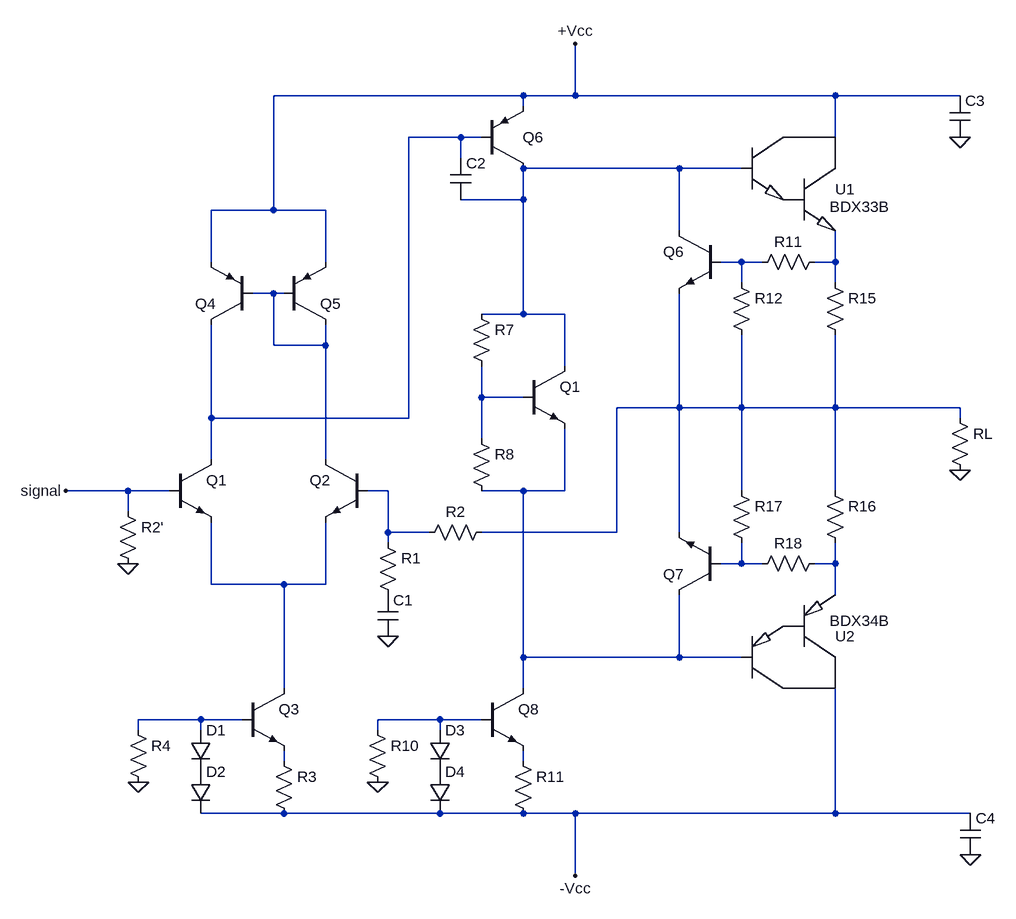
[diagram p0: schematic effektforstaerkerclean.asc]
effektforstaerkerclean.asc, the LTspice schematic file:
Version 4
SHEET 1 952 996
WIRE -16 -304 -400 -304
WIRE 64 -304 64 -384
WIRE 64 -304 -16 -304
WIRE 464 -304 64 -304
WIRE 656 -304 464 -304
WIRE -16 -288 -16 -304
WIRE -112 -240 -192 -240
WIRE -80 -240 -112 -240
WIRE 464 -240 464 -304
WIRE -112 -208 -112 -240
WIRE 224 -192 -16 -192
WIRE 320 -192 224 -192
WIRE -16 -144 -16 -192
WIRE -16 -144 -112 -144
WIRE -400 -128 -400 -304
WIRE -400 -128 -496 -128
WIRE -320 -128 -400 -128
WIRE 224 -96 224 -192
WIRE -496 -48 -496 -128
WIRE -320 -48 -320 -128
WIRE 320 -48 288 -48
WIRE 352 -48 320 -48
WIRE 464 -48 464 -96
WIRE 464 -48 432 -48
WIRE 320 -16 320 -48
WIRE 464 -16 464 -48
WIRE -400 0 -432 0
WIRE -384 0 -400 0
WIRE -16 32 -16 -144
WIRE -16 32 -80 32
WIRE 48 32 -16 32
WIRE -400 80 -400 0
WIRE -320 80 -320 48
WIRE -320 80 -400 80
WIRE 48 112 48 32
WIRE -80 160 -80 112
WIRE -16 160 -80 160
WIRE 224 176 224 0
WIRE 224 176 128 176
WIRE 320 176 320 64
WIRE 320 176 224 176
WIRE 464 176 464 64
WIRE 464 176 320 176
WIRE 656 176 464 176
WIRE -496 192 -496 48
WIRE -192 192 -192 -240
WIRE -192 192 -496 192
WIRE 656 192 656 176
WIRE -80 224 -80 160
WIRE -496 256 -496 192
WIRE -320 256 -320 80
WIRE -624 304 -720 304
WIRE -560 304 -624 304
WIRE -224 304 -256 304
WIRE -16 304 -80 304
WIRE 48 304 48 208
WIRE 48 304 -16 304
WIRE 320 304 320 176
WIRE 464 304 464 176
WIRE -624 336 -624 304
WIRE -224 368 -224 304
WIRE -160 368 -224 368
WIRE 128 368 128 176
WIRE 128 368 -80 368
WIRE 224 368 224 176
WIRE -224 384 -224 368
WIRE 320 416 320 384
WIRE 320 416 288 416
WIRE 352 416 320 416
WIRE 464 416 464 384
WIRE 464 416 432 416
WIRE -496 448 -496 352
WIRE -384 448 -496 448
WIRE -320 448 -320 352
WIRE -320 448 -384 448
WIRE 464 464 464 416
WIRE -16 560 -16 304
WIRE 224 560 224 464
WIRE 224 560 -16 560
WIRE 320 560 224 560
WIRE -384 608 -384 448
WIRE -16 608 -16 560
WIRE -512 656 -608 656
WIRE -448 656 -512 656
WIRE -144 656 -240 656
WIRE -80 656 -144 656
WIRE -608 672 -608 656
WIRE -512 672 -512 656
WIRE -240 672 -240 656
WIRE -144 672 -144 656
WIRE -384 720 -384 704
WIRE -16 720 -16 704
WIRE -384 800 -512 800
WIRE -144 800 -384 800
WIRE -16 800 -144 800
WIRE 64 800 -16 800
WIRE 464 800 464 608
WIRE 464 800 64 800
WIRE 672 800 464 800
WIRE 64 896 64 800
FLAG 656 -240 0
FLAG 672 864 0
FLAG -624 416 0
FLAG -720 304 signal
FLAG 656 272 0
FLAG -240 752 0
FLAG -608 752 0
FLAG -224 528 0
FLAG 64 -384 +Vcc
FLAG 64 896 -Vcc
SYMBOL res -96 16 R0
SYMATTR InstName R7
SYMATTR Value ""
SYMBOL res -96 208 R0
SYMATTR InstName R8
SYMATTR Value ""
SYMBOL res 448 -32 R0
SYMATTR InstName R15
SYMATTR Value ""
SYMBOL res 448 288 R0
SYMATTR InstName R16
SYMATTR Value ""
SYMBOL npn -16 112 R0
SYMATTR InstName Q1
SYMATTR Value ""
SYMBOL npn -560 256 R0
SYMATTR InstName Q1
SYMATTR Value ""
SYMBOL npn -256 256 M0
SYMATTR InstName Q2
SYMATTR Value ""
SYMBOL cap 640 -304 R0
SYMATTR InstName C3
SYMATTR Value ""
SYMBOL cap 656 800 R0
SYMATTR InstName C4
SYMATTR Value ""
SYMBOL res -640 320 R0
SYMATTR InstName R2'
SYMATTR Value ""
SYMBOL pnp -432 48 R180
SYMATTR InstName Q4
SYMATTR Value ""
SYMBOL pnp -384 48 M180
SYMATTR InstName Q5
SYMATTR Value ""
SYMBOL myLib\\BDX33B 336 -240 R0
SYMATTR InstName U1
SYMBOL myLib\\BDX34B 320 608 M180
SYMATTR InstName U2
SYMBOL npn 288 -96 M0
SYMATTR InstName Q6
SYMATTR Value ""
SYMBOL npn 288 464 R180
SYMATTR InstName Q7
SYMATTR Value ""
SYMBOL res 640 176 R0
SYMATTR InstName RL
SYMATTR Value ""
SYMBOL res 304 288 R0
SYMATTR InstName R17
SYMATTR Value ""
SYMBOL res 304 -32 R0
SYMATTR InstName R12
SYMATTR Value ""
SYMBOL res 448 -64 R90
WINDOW 0 0 56 VBottom 0
WINDOW 3 32 56 VTop 0
SYMATTR InstName R11
SYMATTR Value ""
SYMBOL res 448 400 R90
WINDOW 0 0 56 VBottom 0
WINDOW 3 32 56 VTop 0
SYMATTR InstName R18
SYMATTR Value ""
SYMBOL pnp -80 -192 M180
WINDOW 0 63 48 Left 0
SYMATTR InstName Q6
SYMATTR Value ""
SYMBOL res -32 704 R0
SYMATTR InstName R11
SYMATTR Value ""
SYMBOL npn -80 608 R0
SYMATTR InstName Q8
SYMATTR Value ""
SYMBOL res -256 656 R0
SYMATTR InstName R10
SYMATTR Value ""
SYMBOL diode -160 672 R0
SYMATTR InstName D3
SYMATTR Value ""
SYMBOL diode -160 736 R0
SYMATTR InstName D4
SYMATTR Value ""
SYMBOL res -400 704 R0
SYMATTR InstName R3
SYMATTR Value ""
SYMBOL npn -448 608 R0
SYMATTR InstName Q3
SYMATTR Value ""
SYMBOL res -624 656 R0
SYMATTR InstName R4
SYMATTR Value ""
SYMBOL diode -528 672 R0
SYMATTR InstName D1
SYMATTR Value ""
SYMBOL diode -528 736 R0
SYMATTR InstName D2
SYMATTR Value ""
SYMBOL res -240 368 R0
SYMATTR InstName R1
SYMATTR Value ""
SYMBOL res -64 352 R90
WINDOW 0 0 56 VBottom 0
WINDOW 3 32 56 VTop 0
SYMATTR InstName R2
SYMATTR Value ""
SYMBOL cap -240 464 R0
SYMATTR InstName C1
SYMATTR Value ""
SYMBOL cap -128 -208 R0
SYMATTR InstName C2
SYMATTR Value ""

The netlist it stands for:
* effektforstaerkerclean.asc
R7 N002 N006
R8 N006 N009
R15 N004 N007
R16 N007 N011
Q1 N002 N006 N009 0
Q1 N001 signal N012 0
Q2 N005 N008 N012 0
C3 +Vcc 0
C4 -Vcc 0
R2' signal 0
Q4 N001 N005 +Vcc 0
Q5 N005 N005 +Vcc 0
XU1 +Vcc N002 N004 BDX33B  ; pins C B E
XU2 -Vcc N009 N011 BDX34B  ; pins C B E
Q6 N002 N003 N007 0
Q7 N009 N010 N007 0
RL N007 0
R17 N007 N010
R12 N003 N007
R11 N004 N003
R18 N011 N010
Q6 N002 N001 +Vcc 0
R11 N016 -Vcc
Q8 N009 N014 N016 0
R10 N014 0
D3 N014 P001
D4 P001 -Vcc
R3 N015 -Vcc
Q3 N012 N013 N015 0
R4 N013 0
D1 N013 P002
D2 P002 -Vcc
R1 N008 P003
R2 N007 N008
C1 P003 0
C2 N001 N002
.model D D
.lib standard.dio
.model NPN NPN
.model PNP PNP
.lib standard.bjt
.lib myLib\BDX33B.lib
.lib myLib\BDX34B.lib
.backanno
.end